# EAGLE design DL card (EAGLE 9.4.2)
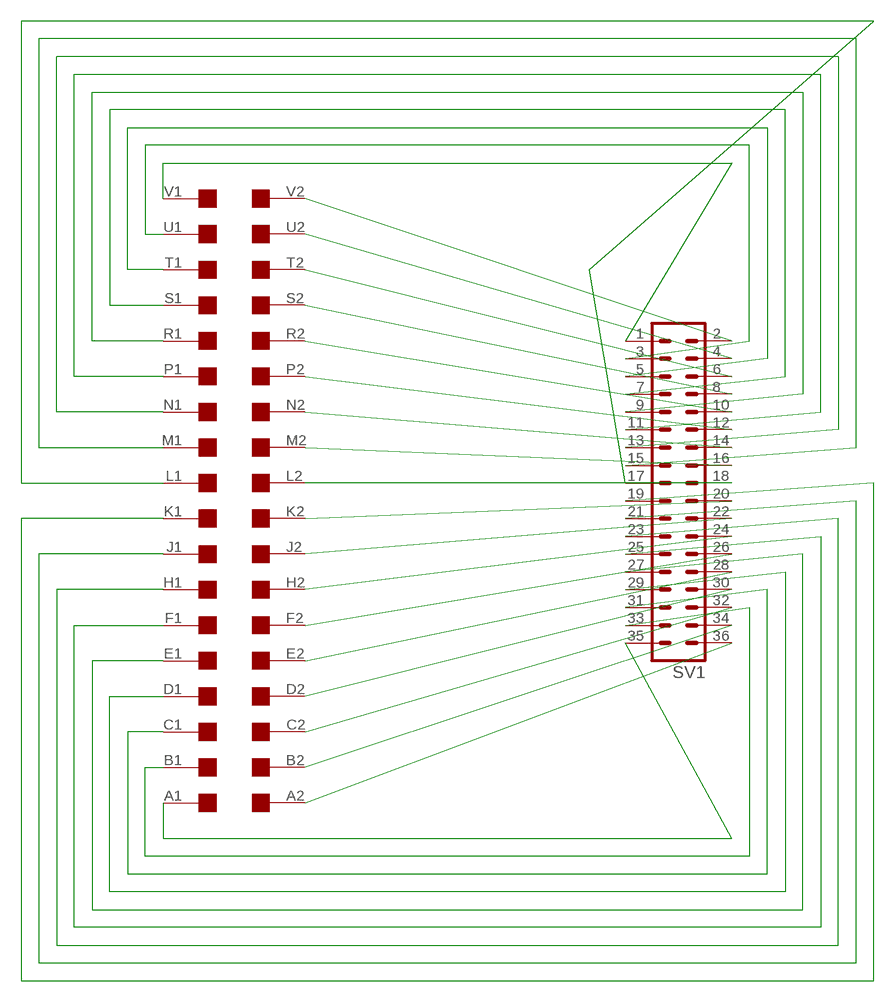
[diagram p0: schematic, sheet 1]

## Parts
EDGE1  EDGE-2CONNECTOR  [EDGE-CON2]
SV1  MA18-2W  [MA18-2W]

## Nets
N$1: EDGE1.V2 SV1.2
N$2: EDGE1.U2 SV1.4
N$3: EDGE1.T2 SV1.6
N$4: EDGE1.S2 SV1.8
N$5: EDGE1.R2 SV1.10
N$6: EDGE1.P2 SV1.12
N$7: EDGE1.N2 SV1.14
N$8: EDGE1.M2 SV1.16
N$9: EDGE1.L2 SV1.18
N$10: EDGE1.K2 SV1.20
N$11: EDGE1.J2 SV1.22
N$12: EDGE1.H2 SV1.24
N$13: EDGE1.F2 SV1.26
N$14: EDGE1.E2 SV1.28
N$15: EDGE1.D2 SV1.30
N$16: EDGE1.C2 SV1.32
N$17: EDGE1.B2 SV1.34
N$18: EDGE1.A2 SV1.36
N$19: EDGE1.V1 SV1.1
N$20: EDGE1.U1 SV1.3
N$21: EDGE1.T1 SV1.5
N$22: EDGE1.S1 SV1.7
N$23: EDGE1.R1 SV1.9
N$24: EDGE1.N1 SV1.13
N$25: EDGE1.P1 SV1.11
N$26: EDGE1.A1 SV1.35
N$27: EDGE1.B1 SV1.33
N$28: EDGE1.C1 SV1.31
N$29: EDGE1.D1 SV1.29
N$30: EDGE1.E1 SV1.27
N$31: EDGE1.F1 SV1.25
N$32: EDGE1.H1 SV1.23
N$33: EDGE1.M1 SV1.15
N$34: EDGE1.J1 SV1.21
N$35: EDGE1.L1 SV1.17
N$36: EDGE1.K1 SV1.19

## Library data of the parts
EDGE1 = dec-con:EDGE-2: Double-Sided DEC edge connector.
SV1 = con-lstb:MA18-2W: PIN HEADER; OC_FARNELL: unknown; OC_NEWARK: unknown

## Board
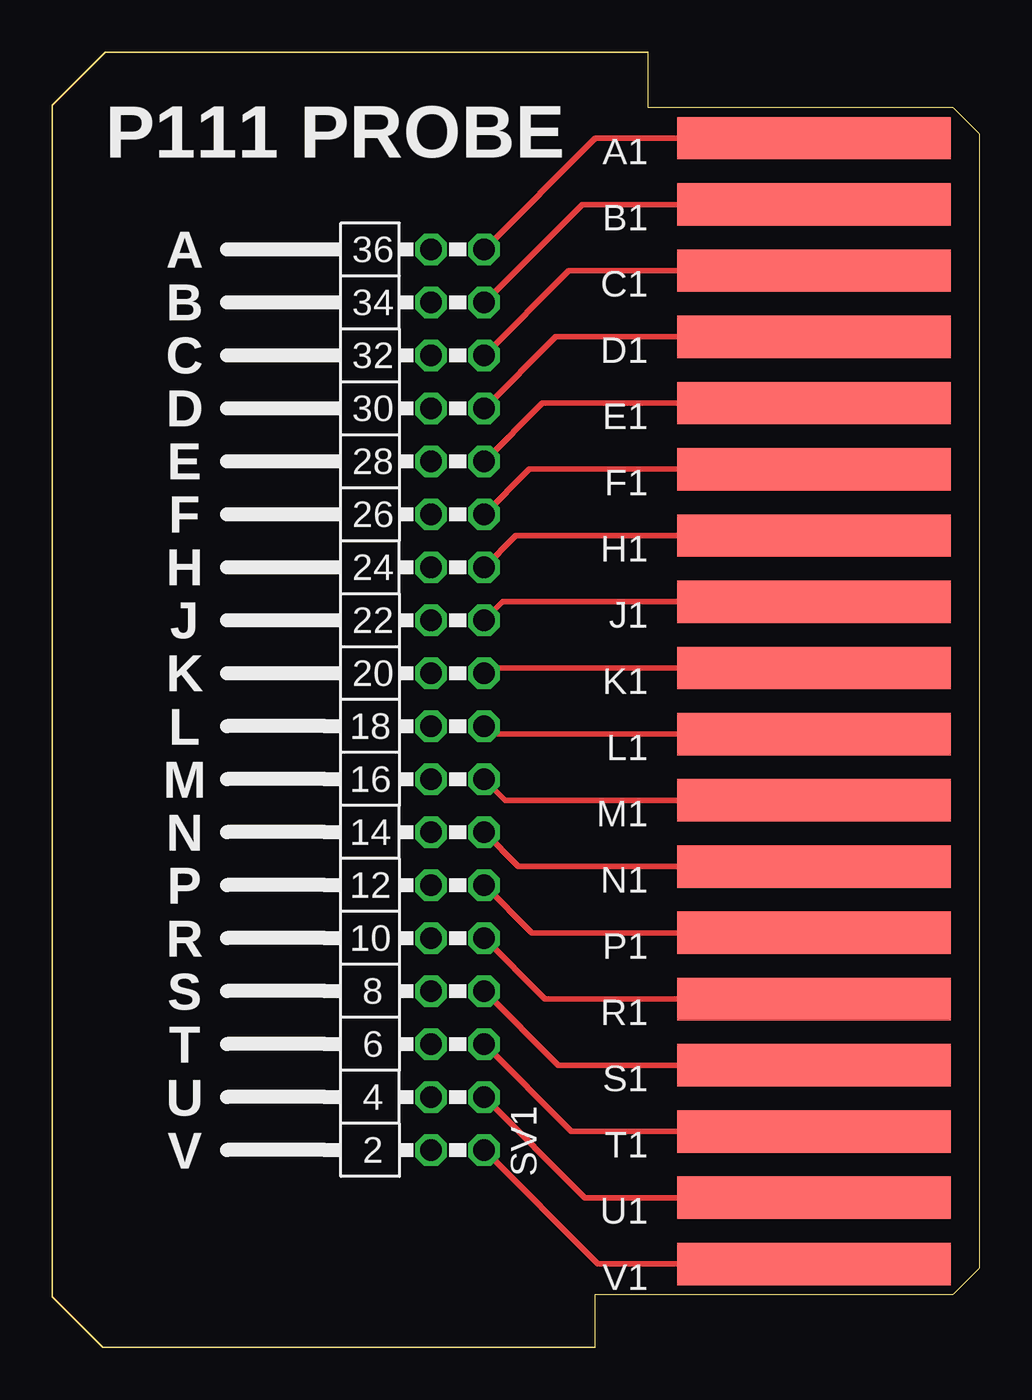
[diagram p1: board, top side]
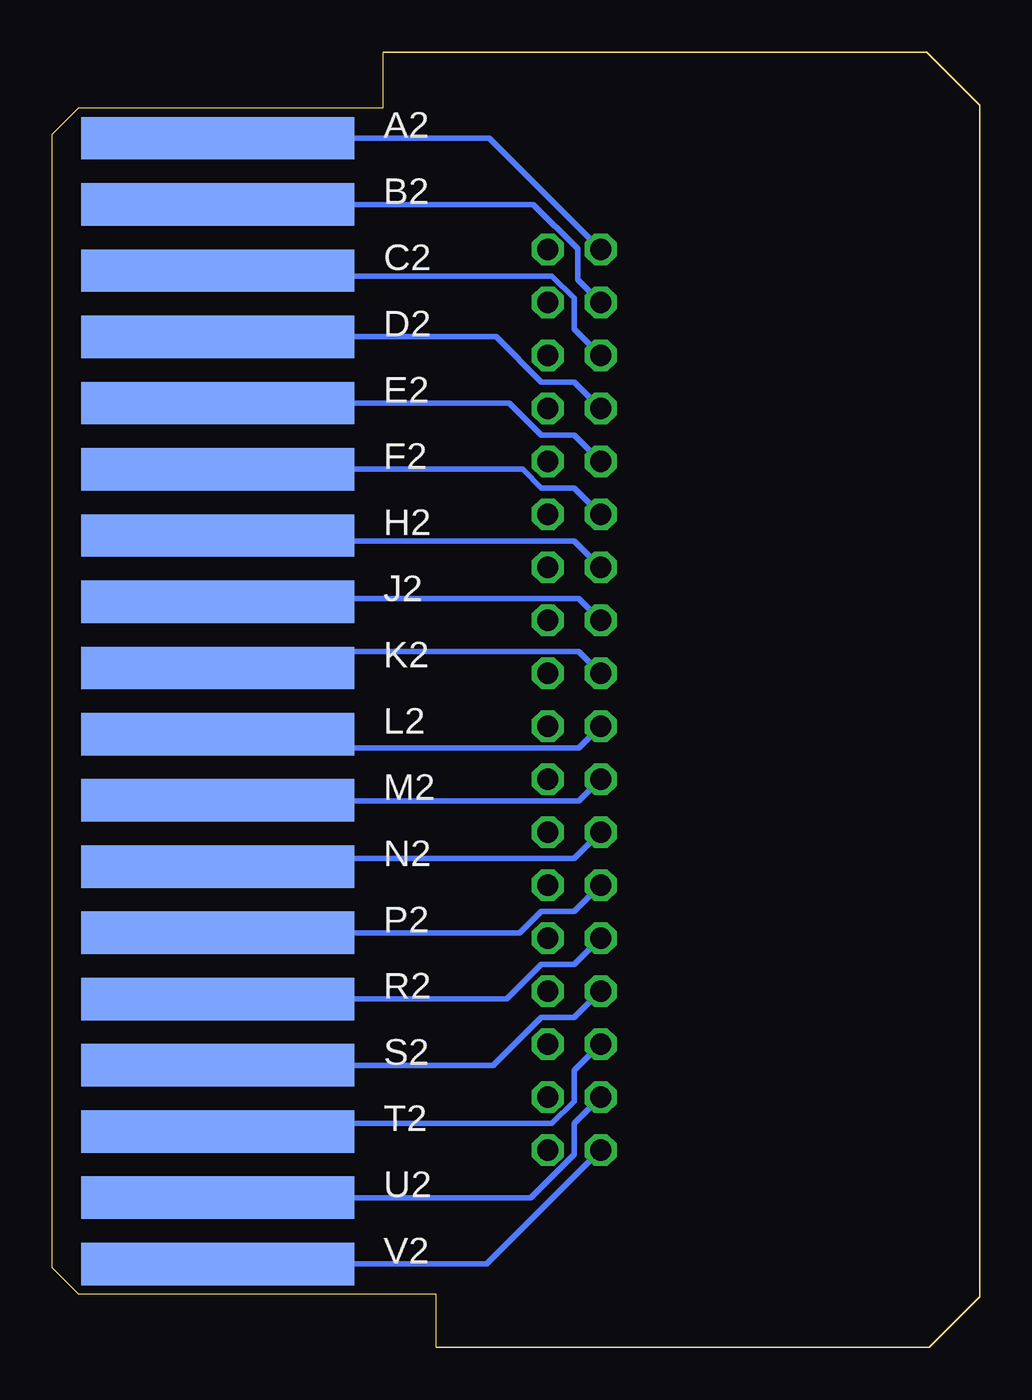
[diagram p2: board, bottom side, seen from below]

Size 44.45 x 62.1 mm. Coordinates in mm from the lower left corner, seen from the top.
Outline: 28.57,62.1 2.54,62.1 0,59.56 0,2.41 2.41,0 26.03,0
Copper layers (1*16): Top 0.035mm / dielectric 1.5mm / Bottom 0.035mm
Design rules "default": minimum track width 6mil, minimum drill 0.35mm, track to track 6mil, track to pad 6mil, pad to pad 6mil, via to via 6mil, smd to smd 6mil, copper to edge 40mil, drill to drill 6mil, minimum pad ring 10mil, minimum via ring 8mil, stop-mask expansion 4mil, vias tented up to drill 0mil, thermal gap 10mil

### Footprints (pad centres in the part's own frame; a part is rotated, then mirrored left to right if it is on the bottom)
EDGE-CON2 = smd 13.106 x 2.032: A1 7.938,4.128; B1 7.938,7.303; C1 7.938,10.477; D1 7.938,13.652; E1 7.938,16.828; F1 7.938,20.003; H1 7.938,23.177; J1 7.938,26.352; K1 7.938,29.527; L1 7.938,32.703; M1 7.938,35.877; N1 7.938,39.053; P1 7.938,42.227; R1 7.938,45.403; S1 7.938,48.578; T1 7.938,51.752; U1 7.938,54.928; V1 7.938,58.102 | smd 13.106 x 2.032 bottom: A2 7.938,4.128; B2 7.938,7.303; C2 7.938,10.477; D2 7.938,13.652; E2 7.938,16.828; F2 7.938,20.003; H2 7.938,23.177; J2 7.938,26.352; K2 7.938,29.527; L2 7.938,32.703; M2 7.938,35.877; N2 7.938,39.053; P2 7.938,42.227; R2 7.938,45.403; S2 7.938,48.578; T2 7.938,51.752; U2 7.938,54.928; V2 7.938,58.102
MA18-2W = drill 1.016 octagon: 1 -21.59,-1.27; 2 -21.59,1.27; 3 -19.05,-1.27; 4 -19.05,1.27; 5 -16.51,-1.27; 6 -16.51,1.27; 7 -13.97,-1.27; 8 -13.97,1.27; 9 -11.43,-1.27; 10 -11.43,1.27; 11 -8.89,-1.27; 12 -8.89,1.27; 13 -6.35,-1.27; 14 -6.35,1.27; 15 -3.81,-1.27; 16 -3.81,1.27; 17 -1.27,-1.27; 18 -1.27,1.27; 19 1.27,-1.27; 20 1.27,1.27; 21 3.81,-1.27; 22 3.81,1.27; 23 6.35,-1.27; 24 6.35,1.27; 25 8.89,-1.27; 26 8.89,1.27; 27 11.43,-1.27; 28 11.43,1.27; 29 13.97,-1.27; 30 13.97,1.27; 31 16.51,-1.27; 32 16.51,1.27; 33 19.05,-1.27; 34 19.05,1.27; 35 21.59,-1.27; 36 21.59,1.27

### Placement (x,y rotation side)
EDGE1  44.45,62.1 180 top
SV1  19.43,31.05 90 top

### Tracks (layer width: path | path; a pad name or v marks a point on that pad's centre or on a via)
N$1
  Bottom 0.254: EDGE1.V2 23.62,4 SV1.2
N$2
  Bottom 0.254: EDGE1.U2 21.51,7.18 19.43,9.26 19.43,10.73 SV1.4
N$3
  Bottom 0.254: EDGE1.T2 36.13,10.73 20.5,10.73 19.43,11.8 19.43,13.27 SV1.6
N$4
  Bottom 0.254: EDGE1.S2 23.3,13.53 21.02,15.81 19.43,15.81 SV1.8
N$5
  Bottom 0.254: EDGE1.R2 22.67,16.7 21.02,18.35 19.43,18.35 SV1.10
N$6
  Bottom 0.254: EDGE1.P2 22.03,19.88 21.02,20.89 19.43,20.89 SV1.12
N$7
  Bottom 0.254: EDGE1.N2 36.13,23.43 19.43,23.43 SV1.14
N$8
  Bottom 0.254: EDGE1.M2 36.49,26.2 19.2,26.2 SV1.16
N$9
  Bottom 0.254: EDGE1.L2 35.85,28.74 19.2,28.74 SV1.18
N$10
  Bottom 0.254: EDGE1.K2 35.72,33.36 19.2,33.36 SV1.20
N$11
  Bottom 0.254: EDGE1.J2 36.36,35.9 19.2,35.9 SV1.22
N$12
  Bottom 0.254: EDGE1.H2 36.26,38.67 19.43,38.67 SV1.24
N$13
  Bottom 0.254: EDGE1.F2 21.91,42.1 21.02,41.21 19.43,41.21 SV1.26
N$14
  Bottom 0.254: EDGE1.E2 22.54,45.28 21.02,43.75 19.43,43.75 SV1.28
N$15
  Bottom 0.254: EDGE1.D2 23.18,48.45 21.02,46.29 19.43,46.29 SV1.30
N$16
  Bottom 0.254: EDGE1.C2 36.26,51.37 20.5,51.37 19.43,50.3 19.43,48.83 SV1.32
N$17
  Bottom 0.254: EDGE1.B2 21.39,54.8 19.26,52.68 19.26,51.2 SV1.34
N$18
  Bottom 0.254: EDGE1.A2 23.49,57.98 SV1.36
N$19
  Top 0.254: EDGE1.V1 26.16,4 SV1.1
N$20
  Top 0.254: EDGE1.U1 25.53,7.18 SV1.3
N$21
  Top 0.254: EDGE1.T1 24.89,10.35 SV1.5
N$22
  Top 0.254: EDGE1.S1 24.26,13.53 SV1.7
N$23
  Top 0.254: EDGE1.R1 23.62,16.7 SV1.9
N$24
  Top 0.254: EDGE1.N1 22.35,23.05 SV1.13
N$25
  Top 0.254: EDGE1.P1 22.99,19.88 SV1.11
N$26
  Top 0.254: EDGE1.A1 26.03,57.98 SV1.35
N$27
  Top 0.254: EDGE1.B1 25.4,54.8 SV1.33
N$28
  Top 0.254: EDGE1.C1 24.77,51.63 SV1.31
N$29
  Top 0.254: EDGE1.D1 24.13,48.45 SV1.29
N$30
  Top 0.254: EDGE1.E1 23.49,45.28 SV1.27
N$31
  Top 0.254: EDGE1.F1 22.86,42.1 SV1.25
N$32
  Top 0.254: EDGE1.H1 22.22,38.93 SV1.23
N$33
  Top 0.254: EDGE1.M1 21.72,26.23 SV1.15
N$34
  Top 0.254: EDGE1.J1 21.59,35.75 SV1.21
N$35
  Top 0.254: EDGE1.L1 21.08,29.4 SV1.17
N$36
  Top 0.254: EDGE1.K1 20.95,32.58 SV1.19

### Text on the board
tPlace: A / B / C / D / E / F / H / J / K / L / M / N / P / R / S / T / U / V
tNames: P111 PROBE